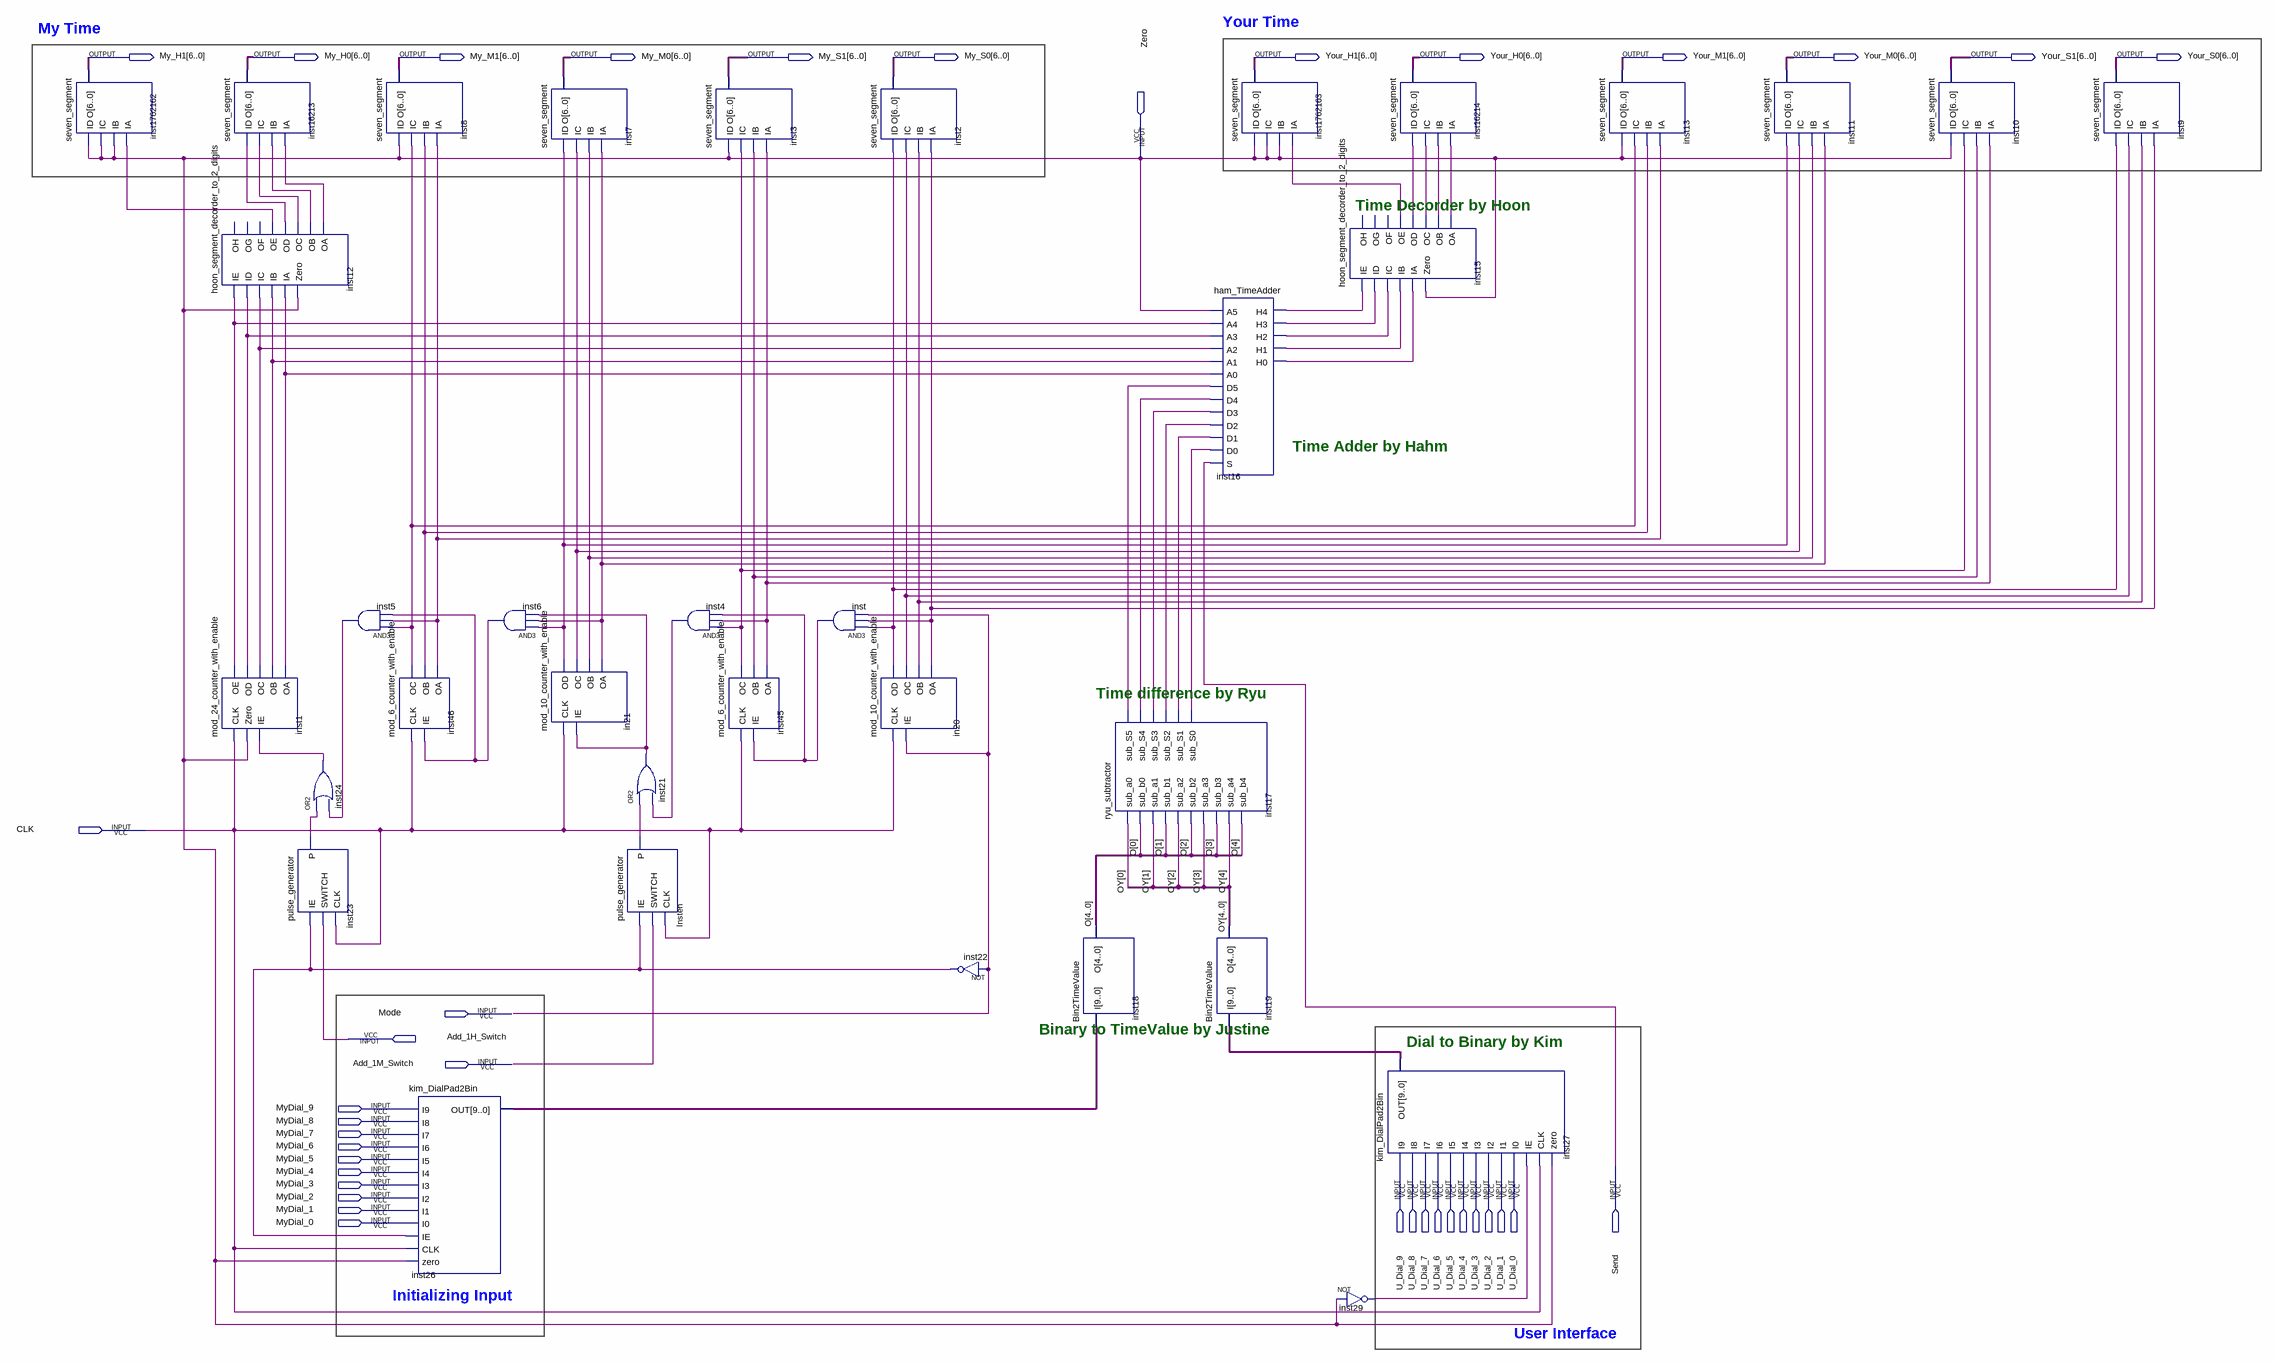
[diagram p0: schematic sheet]
// Quartus schematic digital_clock.bdf as structural Verilog: 35 symbols, 38 pins
module digital_clock (
  input  Zero,
  input  CLK,
  input  Mode,
  input  Add_1H_Switch,
  input  Add_1M_Switch,
  input  MyDial_9,
  input  MyDial_8,
  input  MyDial_7,
  input  MyDial_6,
  input  MyDial_5,
  input  U_Dial_9,
  input  U_Dial_8,
  input  U_Dial_7,
  input  U_Dial_6,
  input  U_Dial_5,
  input  U_Dial_4,
  input  U_Dial_3,
  input  U_Dial_2,
  input  U_Dial_1,
  input  U_Dial_0,
  input  Send,
  input  MyDial_4,
  input  MyDial_3,
  input  MyDial_2,
  input  MyDial_1,
  input  MyDial_0,
  output [6:0] My_H1,
  output [6:0] My_H0,
  output [6:0] My_M1,
  output [6:0] My_M0,
  output [6:0] My_S1,
  output [6:0] My_S0,
  output [6:0] Your_H1,
  output [6:0] Your_H0,
  output [6:0] Your_M1,
  output [6:0] Your_M0,
  output [6:0] Your_S1,
  output [6:0] Your_S0
);

  wire in20_oa, in20_ob, in20_oc, in20_od, in21_oa, in21_ob, in21_oc, in21_od, inst1_oa, inst1_ob, inst1_oc,
       inst1_od, inst1_oe, inst4_out, inst5_out, inst6_out, inst12_oa, inst12_ob, inst12_oc, inst12_od,
       inst12_oe, inst15_oa, inst15_ob, inst15_oc, inst15_od, inst15_oe, inst16_h0, inst16_h1, inst16_h2,
       inst16_h3, inst16_h4, inst17_sub_s0, inst17_sub_s1, inst17_sub_s2, inst17_sub_s3, inst17_sub_s4,
       inst17_sub_s5, inst21_out, inst22_out, inst23_p, inst24_out, inst29_out, inst45_oa, inst45_ob,
       inst45_oc, inst46_oa, inst46_ob, inst46_oc, inst_out, Insten_p;
  wire [4:0] O, OY;
  wire [9:0] inst26_out, inst27_out;

  seven_segment inst1762162 (.ID(Zero), .IC(Zero), .IB(Zero), .IA(inst12_oe), .O(My_H1));
  hoon_segment_decorder_to_2_digits inst12 (
    .IE(inst1_oe), .ID(inst1_od), .IC(inst1_oc), .IB(inst1_ob), .IA(inst1_oa), .Zero(Zero), .OE(inst12_oe),
    .OD(inst12_od), .OC(inst12_oc), .OB(inst12_ob), .OA(inst12_oa));  // open: OH, OG, OF
  mod_24_counter_with_enable inst1 (
    .CLK(CLK), .Zero(Zero), .IE(inst24_out), .OE(inst1_oe), .OD(inst1_od), .OC(inst1_oc), .OB(inst1_ob),
    .OA(inst1_oa));
  seven_segment inst16213 (.ID(inst12_od), .IC(inst12_oc), .IB(inst12_ob), .IA(inst12_oa), .O(My_H0));
  or inst24 (inst24_out, inst23_p, inst5_out);
  pulse_generator inst23 (.IE(inst22_out), .SWITCH(Add_1H_Switch), .CLK(CLK), .P(inst23_p));
  and inst5 (inst5_out, inst46_oc, inst46_oa, inst6_out);
  seven_segment inst8 (.ID(Zero), .IC(inst46_oc), .IB(inst46_ob), .IA(inst46_oa), .O(My_M1));
  mod_6_counter_with_enable inst46 (.CLK(CLK), .IE(inst6_out), .OC(inst46_oc), .OB(inst46_ob), .OA(inst46_oa));
  kim_DialPad2Bin inst26 (
    .I9(MyDial_9), .I8(MyDial_8), .I7(MyDial_7), .I6(MyDial_6), .I5(MyDial_5), .I4(MyDial_4), .I3(MyDial_3),
    .I2(MyDial_2), .I1(MyDial_1), .I0(MyDial_0), .IE(inst22_out), .CLK(CLK), .zero(Zero), .OUT(inst26_out));
  and inst6 (inst6_out, in21_od, in21_oa, inst21_out);
  seven_segment inst7 (.ID(in21_od), .IC(in21_oc), .IB(in21_ob), .IA(in21_oa), .O(My_M0));
  mod_10_counter_with_enable in21 (.CLK(CLK), .IE(inst21_out), .OD(in21_od), .OC(in21_oc), .OB(in21_ob), .OA(in21_oa));
  pulse_generator Insten (.IE(inst22_out), .SWITCH(Add_1M_Switch), .CLK(CLK), .P(Insten_p));
  and inst4 (inst4_out, inst45_oc, inst45_oa, inst_out);
  or inst21 (inst21_out, Insten_p, inst4_out);
  seven_segment inst3 (.ID(Zero), .IC(inst45_oc), .IB(inst45_ob), .IA(inst45_oa), .O(My_S1));
  mod_6_counter_with_enable inst45 (.CLK(CLK), .IE(inst_out), .OC(inst45_oc), .OB(inst45_ob), .OA(inst45_oa));
  and inst (inst_out, in20_od, in20_oa, Mode);
  seven_segment inst2 (.ID(in20_od), .IC(in20_oc), .IB(in20_ob), .IA(in20_oa), .O(My_S0));
  mod_10_counter_with_enable in20 (.CLK(CLK), .IE(Mode), .OD(in20_od), .OC(in20_oc), .OB(in20_ob), .OA(in20_oa));
  not inst22 (inst22_out, Mode);
  Bin2TimeValue inst18 (.I(inst26_out), .O(O));
  ryu_subtractor inst17 (
    .sub_a0(OY[0]), .sub_b0(O[0]), .sub_a1(OY[1]), .sub_b1(O[1]), .sub_a2(OY[2]), .sub_b2(O[2]),
    .sub_a3(OY[3]), .sub_b3(O[3]), .sub_a4(OY[4]), .sub_b4(O[4]), .sub_S5(inst17_sub_s5),
    .sub_S4(inst17_sub_s4), .sub_S3(inst17_sub_s3), .sub_S2(inst17_sub_s2), .sub_S1(inst17_sub_s1),
    .sub_S0(inst17_sub_s0));
  seven_segment inst1762163 (.ID(Zero), .IC(Zero), .IB(Zero), .IA(inst15_oe), .O(Your_H1));
  ham_TimeAdder inst16 (
    .A5(Zero), .A4(inst1_oe), .A3(inst1_od), .A2(inst1_oc), .A1(inst1_ob), .A0(inst1_oa), .D5(inst17_sub_s5),
    .D4(inst17_sub_s4), .D3(inst17_sub_s3), .D2(inst17_sub_s2), .D1(inst17_sub_s1), .D0(inst17_sub_s0),
    .S(Send), .H4(inst16_h4), .H3(inst16_h3), .H2(inst16_h2), .H1(inst16_h1), .H0(inst16_h0));
  Bin2TimeValue inst19 (.I(inst27_out), .O(OY));
  hoon_segment_decorder_to_2_digits inst15 (
    .IE(inst16_h4), .ID(inst16_h3), .IC(inst16_h2), .IB(inst16_h1), .IA(inst16_h0), .Zero(Zero),
    .OE(inst15_oe), .OD(inst15_od), .OC(inst15_oc), .OB(inst15_ob), .OA(inst15_oa));  // open: OH, OG, OF
  kim_DialPad2Bin inst27 (
    .I9(U_Dial_9), .I8(U_Dial_8), .I7(U_Dial_7), .I6(U_Dial_6), .I5(U_Dial_5), .I4(U_Dial_4), .I3(U_Dial_3),
    .I2(U_Dial_2), .I1(U_Dial_1), .I0(U_Dial_0), .IE(inst29_out), .CLK(CLK), .zero(Zero), .OUT(inst27_out));
  not inst29 (inst29_out, Zero);
  seven_segment inst16214 (.ID(inst15_od), .IC(inst15_oc), .IB(inst15_ob), .IA(inst15_oa), .O(Your_H0));
  seven_segment inst13 (.ID(Zero), .IC(inst46_oc), .IB(inst46_ob), .IA(inst46_oa), .O(Your_M1));
  seven_segment inst11 (.ID(in21_od), .IC(in21_oc), .IB(in21_ob), .IA(in21_oa), .O(Your_M0));
  seven_segment inst10 (.ID(Zero), .IC(inst45_oc), .IB(inst45_ob), .IA(inst45_oa), .O(Your_S1));
  seven_segment inst9 (.ID(in20_od), .IC(in20_oc), .IB(in20_ob), .IA(in20_oa), .O(Your_S0));

  // Notes on the sheet:
  //   Your Time
  //   My Time
  //   Time Decorder by Hoon
  //   Time Adder by Hahm
  //   Time difference by Ryu
  //   Binary to TimeValue by Justine
  //   Dial to Binary by Kim
  //   Initializing Input
  //   User Interface
endmodule
